# EAGLE design M8-TempAlarm (EAGLE 9.6.2)
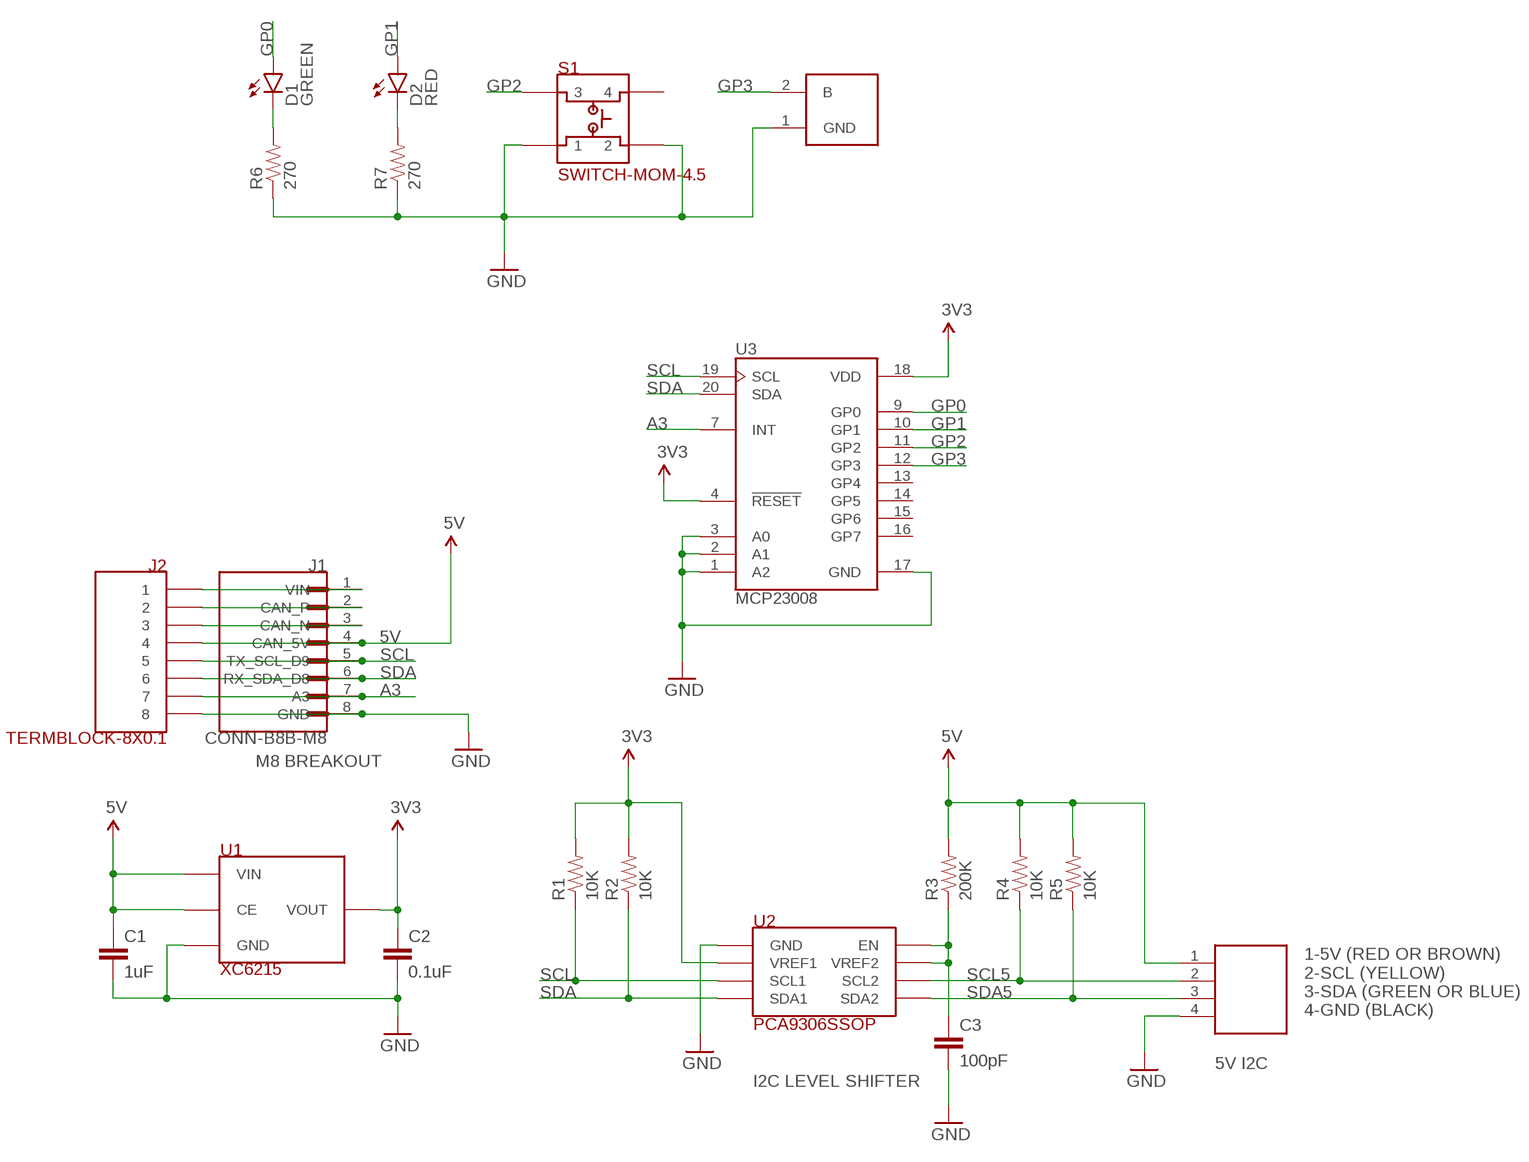
[diagram p0: schematic, sheet 1]

## Parts
C1  1uF  CAP-1UF-0603.DEV  [0603-CAP]
C2  0.1uF  CAP-0.1UF-0603  [0603-CAP]
C3  100pF  CAP-100PF-0603  [0603-CAP]
D1  GREEN  LED-GREEN0603  [LED-0603]
D2  RED  LED-RED  [LED-0603]
J1  CONN-B8B-M8  [JST_B8B-PH-SM4-TB(LF)(SN)]
J2  TERMBLOCK-8X0.1  [TERMBLOCK-8X0.1]
R1  10K  RES-10K-06030603  [0603-RES]
R2  10K  RES-10K-06030603  [0603-RES]
R3  200K  RES-200K-0603  [0603-RES]
R4  10K  RES-10K-06030603  [0603-RES]
R5  10K  RES-10K-06030603  [0603-RES]
R6  270  RES-270-0603.DEV  [0603-RES]
R7  270  RES-270-0603.DEV  [0603-RES]
S1  SWITCH-MOM-4.5  [SWITCH-MOM-4.5]
U1  XC6215  [SOT-25-TOREX]
U2  PCA9306SSOP  [8-SSOP-TI]
U3  MCP23008  MCP23008T-E/ML  [QFN21P50_400X400X100L40X24T270N]
U$1  TERMBLOCK-4X0.15  [TERMBLOCK-4X0.15]
U$2  BUZZER2  [BUZZER2]

## Nets
3V3: C2.1 R1.2 R2.2 U1.5(VOUT) U2.2(VREF1) U3.4(!RESET) U3.18(VDD)
5V: C1.1 J1.4(CAN_5V) J2.P$4 R3.2 R4.2 R5.2 U1.1(VIN) U1.3(CE) U$1.1
A3: J1.7(A3) J2.P$7 U3.7(INT)
CAN_N: J1.3(CAN_N) J2.P$3
CAN_P: J1.2(CAN_P) J2.P$2
GND: C1.2 C2.2 C3.2 J1.8(GND) J2.P$8 R6.1 R7.1 S1.1 S1.2 U1.2(GND) U2.1(GND) U3.1(A2) U3.2(A1) U3.3(A0) U3.17(GND) U$1.4 U$2.1(GND)
GP0: D1.A U3.9(GP0)
GP1: D2.A U3.10(GP1)
GP2: S1.3 U3.11(GP2)
GP3: U3.12(GP3) U$2.2(B)
N$6: D2.C R7.2
N$7: D1.C R6.2
SCL: J1.5(TX_SCL_D9) J2.P$5 R1.1 U2.3(SCL1) U3.19(SCL)
SCL5: R4.1 U2.6(SCL2) U$1.2
SDA: J1.6(RX_SDA_D8) J2.P$6 R2.1 U2.4(SDA1) U3.20(SDA)
SDA5: R5.1 U2.5(SDA2) U$1.3
VIN: J1.1(VIN) J2.P$1
VREF2_EN: C3.1 R3.1 U2.7(VREF2) U2.8(EN)
Unconnected: S1.4 U3.13(GP4) U3.14(GP5) U3.15(GP6) U3.16(GP7)

## Notes on the sheet
- M8 BREAKOUT
- 1-5V (RED OR BROWN)
  2-SCL (YELLOW)
  3-SDA (GREEN OR BLUE)
  4-GND (BLACK)
- 5V I2C
- I2C LEVEL SHIFTER

## Library data of the parts
C1 = rickk2:CAP-1UF-0603.DEV: CAP CER 1UF 25V X7R 0603 $ 0.10 Samsung CL10B105KA8NNNC https://www.digikey.com/product-detail/en/samsung-electro-mechanics-america-inc/CL10B105KA8NNNC/1276-1184-1-ND/3889270 1µF ±10% 25V Ceramic Capacitor X7R 0603 (1608 Metric)
C2 = rickk2:CAP-0.1UF-0603: CAP CER 0.1UF 16V X7R 0603 https://www.digikey.com/product-detail/en/murata-electronics-north-america/GRM188R71C104KA01D/490-1532-1-ND/587771
C3 = rickk2:CAP-100PF-0603: CAP 100PF 0603
D1 = rickk2:LED-GREEN: Lite-On LTST-C193KGKT-5A Green 572nm LED Indication - Discrete 2V 5 mA 0603 https://www.digikey.com/product-detail/en/lite-on-inc/LTST-C193KGKT-5A/160-1828-1-ND/2356247 Res = 270 ohm @ 3.3V, Res = 680 ohm 1/8W @ 5V
D2 = rickk2:LED-RED: LED RED CLEAR 0603 SMD $0.41 Red 631nm LED Indication - Discrete 2V 0603 (1608 Metric) 5mA@2V https://www.digikey.com/product-detail/en/lite-on-inc/LTST-C193KRKT-5A/160-1830-1-ND/2356251 Res = 270 ohm @ 3.3V Res = 680 ohm 1/8W @ 5V Res = 2.2K 1/8W @ 12V
J1 = rickk2:CONN-B8B-M8: PH Series 2 mm Pitch 12 Position SMT Single Row Top Entry Shrouded Header
J2 = rickk2:TERMBLOCK-8X0.1: Term Block 8x0.1" 20-30AWG 6A 125V Max Side Entry On Shore Technology Inc. OSTVN08A150 TERM BLK 8P SIDE ENT 2.54MM PCB 8 Position Wire to Board Terminal Block Horizontal with Board 0.100" (2.54mm) Through Hole https://www.digikey.com/product-detail/en/on-shore-technology-inc/OSTVN08A150/ED10566-ND/1588868
R1 R2 R4 R5 = rickk2:RES-10K-0603: RES SMD 10K OHM 5% 1/4W 0603 $ 0.10 https://www.digikey.com/product-detail/en/panasonic-electronic-components/ERJ-PA3J103V/P10KBZCT-ND/5036237
R3 = rickk2:RES-200K-0603: RES SMD 200K https://www.digikey.com/product-detail/en/panasonic-electronic-components/ERJ-3EKF2003V/P200KHCT-ND/198241
R6 R7 = rickk2:RES-270-0603.DEV: RES SMD 270 OHM 5% 1/10W 0603 $0.10 Panasonic ERJ-3GEYJ271V ±5% 0.1W, 1/10W Chip Resistor 0603 (1608 Metric) Automotive AEC-Q200 Thick Film https://www.digikey.com/product-detail/en/panasonic-electronic-components/ERJ-3GEYJ271V/P270GCT-ND/134766
S1 = rickk2:SWITCH-MOM-4.5: Manufacturer: E-Switch Manufacturer Part Number: TL3305AF160QG Description: SWITCH TACTILE SPST-NO 50MA 12V Detailed Description: Tactile Switch SPST-NO Top Actuated Surface Mount $0.20 https://www.digikey.com/product-detail/en/e-switch/TL3305AF160QG/EG5350CT-ND/5816195
U1 = rickk2:XC6215: IC REG LINEAR 3.3V 200MA SOT25 Torex Semiconductor Ltd XC6215B332MR-G $0.71 Linear Voltage Regulator IC 1 Output 200mA SOT-25 https://www.digikey.com/product-detail/en/torex-semiconductor-ltd/XC6215B332MR-G/893-1078-1-ND/2138269 - Not ordered yet - 6V max input - 3.3V output 200 mA - 1.5µA quiescent current - 1uF input cap, 0.1 uF output cap - CE high to enable
U2 = rickk2:PCA9306: IC TRNSLTR BIDIRECTIONAL SM8 PCA9306DCTR $0.67 https://www.digikey.com/product-detail/en/texas-instruments/PCA9306DCTR/296-18509-1-ND/809938 VREF1=3.3V VREF2=5V connect w/200K res and 100 pF cap to GND Use 8-SSOP version!
U3 = rickk2:MCP23008T-E/ML: Not purchased yet Microchip Technology MCP23008T-E/ML $1.10 I/O Expander 8 I²C 1.7MHz 20-QFN-EP (4x4) https://www.digikey.com/product-detail/en/microchip-technology/MCP23008T-E-ML/MCP23008T-E-MLCT-ND/7916525 MCP23008 Series 5.5 V 1.7 MHz 8-Bit I/O Expander with Serial Interface - QFN-20; ARROW_ELECTRONICS-PURCHASE-URL: https://snapeda.com/shop?store=Arrow+Electronics&id=4816241; DESCRIPTION: IC I/O EXPANDER I2C 8B 20QFN; DIGIKEY-PURCHASE-URL: https://snapeda.com/shop?store=DigiKey&id=4816241; MF: Microchip Technology; MOUSER-PURCHASE-URL: https://snapeda.com/shop?store=Mouser&id=4816241; MP: MCP23008T-E/ML; PACKAGE: None
U$1 = rickk2:TERMBLOCK-4X0.15: Have this - used on GarageDoor2 for prox sensor
U$2 = rickk2:BUZZER2: CUI Devices CPI-1375-80T $1.39 BUZZER, 13.8 MM X 7.5 MM DEEP, P Buzzers Indicator, Internally Driven Piezo 12V 7mA 4kHz 80dB @ 12V, 10cm Through Hole PC Pins https://www.digikey.com/en/products/detail/cui-devices/CPI-1375-80T/10326222

## Board
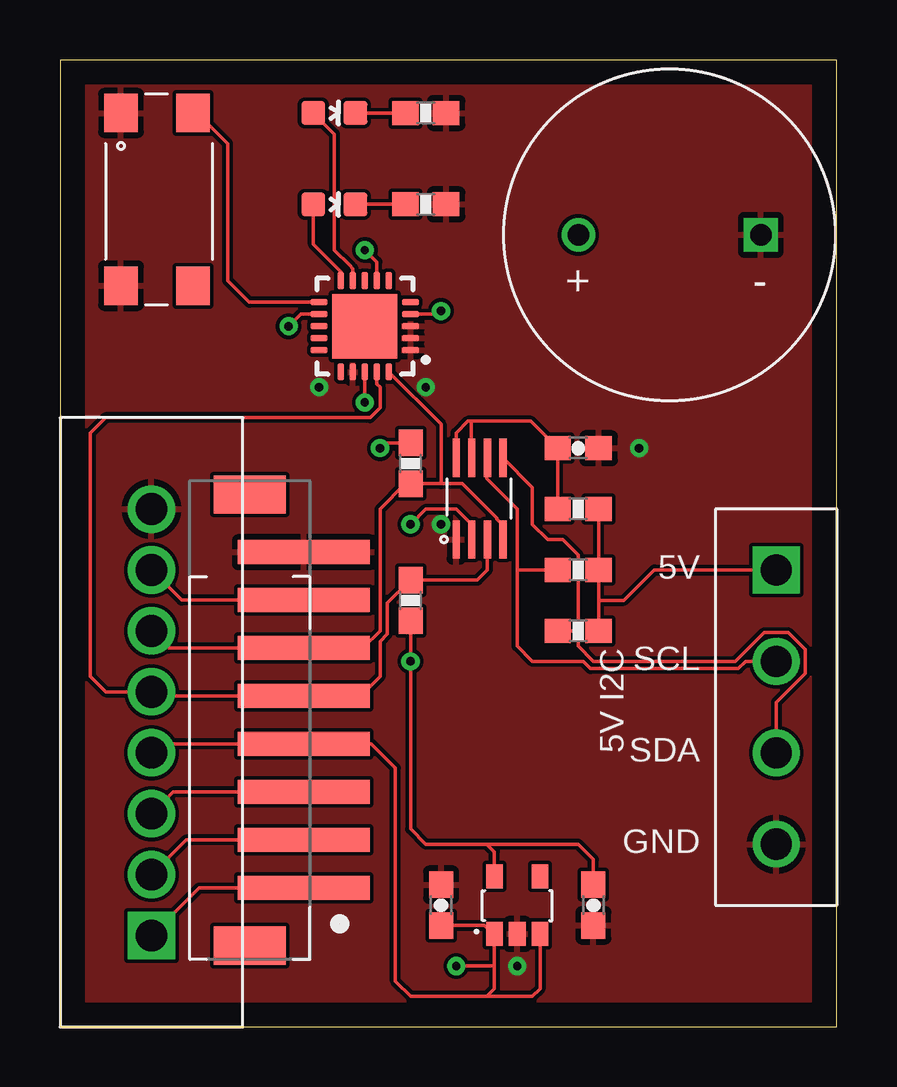
[diagram p1: board, top side]
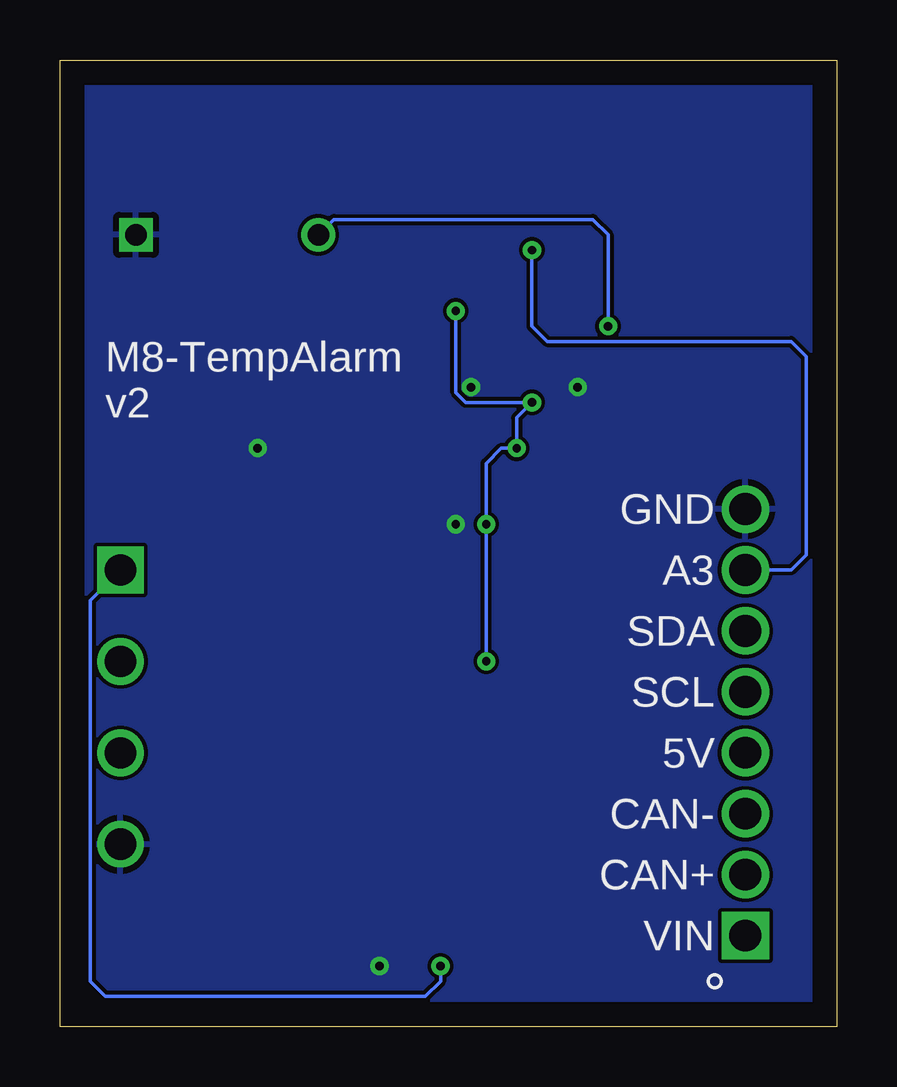
[diagram p2: board, bottom side, seen from below]

Size 32.37 x 40.31 mm. Coordinates in mm from the lower left corner, seen from the top.
Outline: 0,0 32.37,0 32.37,40.31 0,40.31 0,0
Copper layers (1*16): Top 0.035mm / dielectric 1.5mm / Bottom 0.035mm
Design rules "default": minimum track width 6mil, minimum drill 0.35mm, track to track 6mil, track to pad 6mil, pad to pad 6mil, via to via 6mil, smd to smd 6mil, copper to edge 40mil, drill to drill 6mil, minimum pad ring 10mil, minimum via ring 8mil, stop-mask expansion 4mil, vias tented up to drill 0mil, thermal gap 10mil

### Footprints (pad centres in the part's own frame; a part is rotated, then mirrored left to right if it is on the bottom)
0603-CAP = smd 1.1 x 1: 1 -0.85,0; 2 0.85,0
LED-0603 = smd 1 x 1: A 0,-0.877; C 0,0.877
JST_B8B-PH-SM4-TB(LF)(SN) = smd 1 x 5.5: 1 -5,0; 2 -3,0; 3 -1,0; 4 1,0; 5 3,0; 6 5,0; 7 7,0; 8 9,0 | smd 1.6 x 3: P1 -7.4,2.25; P2 11.4,2.25
TERMBLOCK-8X0.1 = drill 1.321 square: P$1 -8.89,0 | drill 1.321: P$2 -6.35,0; P$3 -3.81,0; P$4 -1.27,0; P$5 1.27,0; P$6 3.81,0; P$7 6.35,0; P$8 8.89,0
0603-RES = smd 1.1 x 1: 1 -0.85,0; 2 0.85,0
SWITCH-MOM-4.5 = smd 1.6 x 1.4: 1 0,0; 2 7.2,0; 3 0,3; 4 7.2,3
SOT-25-TOREX = smd 0.7 x 1: 1 -0.95,-1.2; 2 0,-1.2; 3 0.95,-1.2; 4 0.95,1.2; 5 -0.95,1.2
8-SSOP-TI = smd 0.3 x 1.6: 1 0,0; 2 0.65,0; 3 1.3,0; 4 1.95,0; 5 1.95,3.4; 6 1.3,3.4; 7 0.65,3.4; 8 0,3.4
QFN21P50_400X400X100L40X24T270N = smd 0.71 x 0.26: 1 -1.905,1; 2 -1.905,0.5; 3 -1.905,0; 4 -1.905,-0.5; 5 -1.905,-1; 11 1.905,-1; 12 1.905,-0.5; 13 1.905,0; 14 1.905,0.5; 15 1.905,1 | smd 0.26 x 0.71: 6 -1,-1.905; 7 -0.5,-1.905; 8 0,-1.905; 9 0.5,-1.905; 10 1,-1.905; 16 1,1.905; 17 0.5,1.905; 18 0,1.905; 19 -0.5,1.905; 20 -1,1.905 | smd 2.7 x 2.7: 21 0,0
TERMBLOCK-4X0.15 = drill 1.3 square: 1 -3.81,0 | drill 1.3: 2 0,0; 3 3.81,0; 4 7.62,0
BUZZER2 = drill 0.9 square: 1 -3.8,0 | drill 0.9: 2 3.8,0

### Placement (x,y rotation side)
C1  15.88,5.08 90 top
C2  22.23,5.08 270 top
C3  21.59,24.13 0 top
D1  11.43,38.1 270 top
D2  11.43,34.29 270 top
J1  10.16,10.79 90 top
J2  3.81,12.7 90 top
R1  14.61,17.78 270 top
R2  14.61,23.5 90 top
R3  21.59,21.59 0 top
R4  21.59,19.05 0 top
R5  21.59,16.51 0 top
R6  15.24,38.1 180 top
R7  15.24,34.29 180 top
S1  2.54,38.1 270 top
U1  19.05,5.08 0 top
U2  16.51,20.32 0 top
U3  12.7,29.21 180 top
U$1  29.84,15.24 270 top
U$2  25.4,33.02 180 top

### Tracks (layer width: path | path; a pad name or v marks a point on that pad's centre or on a via)
3V3  (via drill 0.35)
  Top 0.152: U2.2 17.16,20.94 16.51,21.59 15.24,21.59 v14.61,20.95 | R1.2 v14.61,15.24 14.61,8.26 15.24,7.62 17.78,7.62 | v13.34,24.13 13.55,24.34 R2.2 | C2.1 22.23,6.99 21.59,7.62 17.78,7.62 | U1.5 18.1,7.3 17.78,7.62 | U3.4 15.74,29.71 v15.88,29.84 | U3.18 v12.7,26.04
  Bottom 0.152: v14.61,15.24 v14.61,20.95 14.61,23.5 13.97,24.13 v13.34,24.13 13.34,25.4 v12.7,26.04 15.46,26.04 15.88,26.45 v15.88,29.84
5V  (via drill 0.35)
  Top 0.152: R5.2 22.44,17.78 | 22.44,17.78 R4.2 R3.2 | 22.44,17.78 23.5,17.78 24.77,19.05 U$1.1 | J2.P$4 4.17,11.79 J1.4 12.97,11.79 13.97,10.79 13.97,1.91 14.61,1.27 17.78,1.27 | U1.3 20,1.58 19.68,1.27 17.78,1.27 | U1.1 18.1,3.81 | 18.1,3.81 18.1,2.54 | 18.1,2.54 18.1,1.59 17.78,1.27 | C1.1 17.68,4.23 18.1,3.81 | v16.51,2.54 18.1,2.54
  Bottom 0.152: U$1.1 31.11,17.78 31.11,1.91 30.48,1.27 17.14,1.27 16.51,1.91 v16.51,2.54
A3  (via drill 0.35)
  Top 0.152: J1.7 5.07,17.8 J2.P$7 | U3.7 13.2,31.89 v12.7,32.38
  Bottom 0.152: v12.7,32.38 12.7,29.21 12.06,28.57 1.91,28.57 1.27,27.94 1.27,19.68 1.91,19.05 J2.P$7
CAN_N
  Top 0.152: J1.3 4.71,9.79 J2.P$3
CAN_P
  Top 0.152: J1.2 5.25,7.79 J2.P$2
GND  (via drill 0.35)
  other vias: 15.88,20.95 24.13,24.13 10.79,26.67 15.24,26.67 19.05,2.54
  pour Top: 0,0 0,44.45 40.64,44.45 40.64,0
  pour Bottom: 0,0 0,43.18 41.91,43.18 41.91,0
GP0
  Top 0.152: D1.A 11.43,37.22 11.43,32.38 12.06,31.75 12.2,31.61 U3.9
GP1
  Top 0.152: D2.A 10.55,33.02 10.55,32.63 11.7,31.48 U3.10
GP2
  Top 0.152: U3.11 7.89,30.21 6.99,31.11 6.99,36.83 5.71,38.1 S1.3
GP3  (via drill 0.35)
  Top 0.152: v9.53,29.21 10.03,29.71 U3.12
  Bottom 0.152: v9.53,29.21 9.53,33.02 10.16,33.66 20.95,33.66 U$2.2
N$6
  Top 0.152: D2.C R7.2
N$7
  Top 0.152: D1.C R6.2
SCL
  Top 0.152: U2.3 17.81,19.05 17.39,18.63 R1.1 13.64,17.66 13.64,16.38 13.34,16.08 13.34,14.61 12.53,13.79 J1.5 3.98,13.79 J2.P$5 1.91,13.97 1.27,14.61 1.27,24.77 1.91,25.4 12.92,25.4 13.34,25.81 13.34,26.67 13.2,26.8 U3.19
SCL5
  Top 0.152: 19.05,19.05 19.05,21.59 17.78,22.86 17.78,23.69 U2.6 | R4.1 19.05,19.05 | U$1.2 28.57,15.24 28.27,14.94 22.1,14.94 21.79,15.24 19.68,15.24 19.05,15.88 19.05,19.05
SDA
  Top 0.152: U2.4 18.46,20.91 18.19,21.18 18.19,21.21 16.76,22.64 15.88,22.64 | J2.P$6 4.53,15.79 J1.6 12.62,15.79 13.34,16.51 13.34,21.59 14.39,22.64 R2.1 15.88,22.64 | U3.20 15.88,25.13 15.88,22.64
SDA5
  Top 0.152: U2.5 19.68,22.5 19.68,20.95 20.32,20.32 20.95,20.32 21.59,19.68 21.59,16.51 | 21.59,16.51 21.59,15.88 22.23,15.24 28.14,15.24 29.31,16.41 29.35,16.44 30.34,16.44 31.05,15.74 31.05,14.74 29.84,13.54 U$1.3 | R5.1 21.59,16.51
VIN
  Top 0.152: J2.P$1 5.79,5.79 J1.1
VREF2_EN
  Top 0.152: R3.1 C3.1 19.62,25.25 17.14,25.25 | U2.8 16.51,24.77 16.99,25.25 17.14,25.25 | U2.7 17.14,23.73 17.14,25.25

### Text on the board
tPlace: 5V | SCL | SDA | 5V I2C | GND
bPlace: M8-TempAlarm / v2 | GND | A3 | SDA | SCL | 5V | CAN- | CAN+ | VIN